# EasyEDA Pro project SCH_and_PCB.epro, board 运放2.0
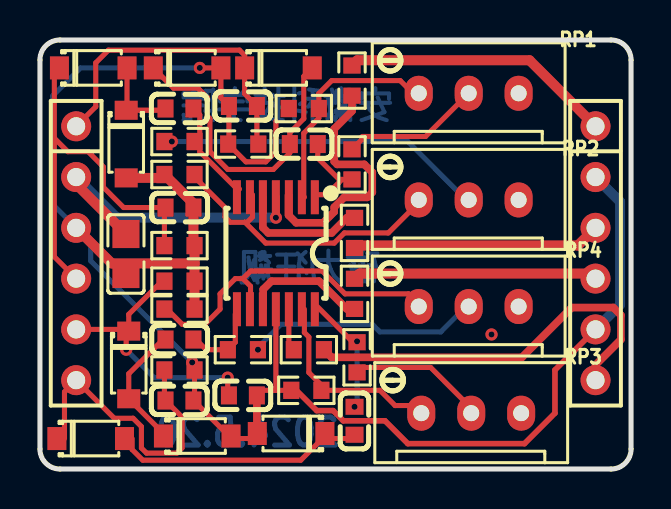
[diagram p12: board, top side]
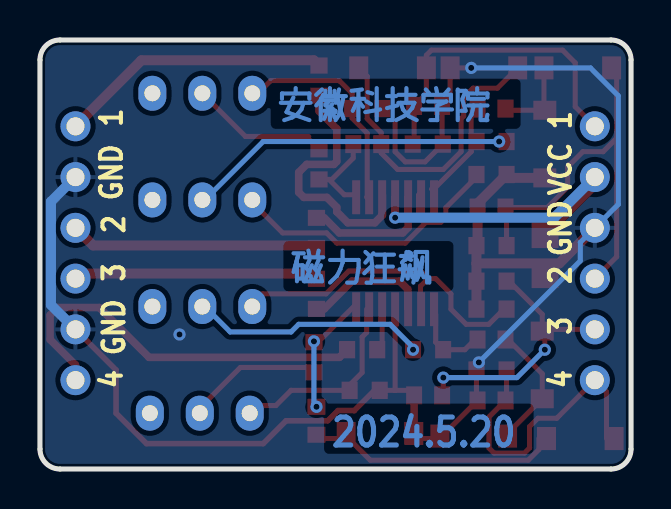
[diagram p13: board, bottom side, seen from below]

Outline 29.59 x 21.46 mm; copper layers: Top Layer, Bottom Layer. Coordinates in mm from the lower left corner of the outline.
Outline path: 0,20.46 0,1 arc(0.29,0.29) 1,0 28.59,0 arc(29.3,0.29) 29.59,1 29.59,20.46 arc(29.3,21.17) 28.59,21.46 1,21.46 arc(0.29,21.17) 0,20.46
Stack: Top Layer 0.035mm / Dielectric1 1.51mm FR4 er 4.5 / Bottom Layer 0.035mm

## Design rules (mm)
template: JLCPCB Capability(Two Layers Board)
spacing copperThickness1oz (default): track to track 0.102, other pairs 0.152 to 0.3
spacing copperThickness2oz: track to track 0.203, other pairs 0.152 to 0.3
track width copperThickness1oz (default): min 0.127, default 0.254, max 2.54
track width copperThickness2oz: min 0.203, default 0.254, max 2.54
differential pair differentialPair (default): width min 0.127, default 0.254, max 2.54; gap min 0.152, default 0.152
via viaSize (default): diameter min 0.5, default 0.61, max 10; hole min 0.3, default 0.305, max 6.3

## Placement (name value [footprint] x y rotation side)
C1  104  [C0603]  13.21 16.26 180 top
C2  104  [C0603]  10.16 18.16 0 top
C3  104  [C0603]  6.98 18.03 0 top
C4  104  [C0603]  6.98 13.08 180 top
C5  104  [C0603]  6.98 6.48 180 top
C6  104  [C0603]  10.16 3.68 0 top
C7  104  [C0603]  15.75 2.41 90 top
C8  104  [C0603]  6.98 3.43 0 top
C9  100nF  [C0805]  4.3 10.76 270 top
D1  B5819W  [SOD-123_L2.8-W1.8-LS3.7-RD]  11.94 20.07 0 top
D2  B5819W  [SOD-123_L2.8-W1.8-LS3.7-RD]  7.37 20.07 0 top
D3  B5819W  [SOD-123_L2.8-W1.8-LS3.7-RD]  2.67 20.07 0 top
D4  B5819W  [SOD-123_L2.8-W1.8-LS3.7-RD]  4.32 16.26 270 top
D5  B5819W  [SOD-123_L2.8-W1.8-LS3.7-RD]  4.44 5.21 270 top
D6  B5819W  [SOD-123_L2.8-W1.8-LS3.7-RD]  7.87 1.65 0 top
D7  B5819W  [SOD-123_L2.8-W1.8-LS3.7-RD]  2.54 1.52 0 top
D8  B5819W  [SOD-123_L2.8-W1.8-LS3.7-RD]  12.57 1.78 180 top
P1  IN  [HDR1X6-M]  27.81 17.14 270 top
P2  OUT  [HDR1X6-M]  1.81 17.14 270 top
R1  5.1K  [R0603]  15.62 19.43 270 top
R2  1K  [R0603]  13.21 18.03 0 top
R3  47K  [R0603]  15.62 15.24 270 top
R4  47k  [R0603]  10.18 16.26 0 top
R5  5.1k  [R0603]  15.75 11.81 90 top
R6  1k  [R0603]  6.98 14.73 0 top
R7  47k  [R0603]  6.98 16.38 0 top
R8  47K  [R0603]  6.98 11.18 180 top
R9  5.1K  [R0603]  15.75 8.76 90 top
R10  1K  [R0603]  6.98 8 0 top
R11  47K  [R0603]  10.16 5.97 0 top
R12  47k  [R0603]  6.98 9.4 0 top
R13  5.1K  [R0603]  13.46 5.97 0 top
R14  1K  [R0603]  13.33 3.94 180 top
R15  47k  [R0603]  15.88 5.59 270 top
R16  47k  [R0603]  6.98 4.95 0 top
RP1  100K  [RES-ADJ-TH_3296W-1-203]  21.46 18.8 180 top
RP2  100K  [RES-ADJ-TH_3296W-1-203]  21.46 13.46 180 top
RP3  100K  [RES-ADJ-TH_3296W-1-203]  21.59 2.79 180 top
RP4  100K  [RES-ADJ-TH_3296W-1-203]  21.46 8.13 180 top
U2  OPA4377AIPW  [TSSOP-14_L5.0-W4.4-P0.65-LS6.4-BL]  11.81 10.8 180 top

## Footprints (pads in the part's own frame, mm; a bottom-side part is the same pattern mirrored in y, then rotated)
C0603
  rect 0.8x0.9 smd: 1(-0.7,0) 2(0.7,0)
C0805
  rect 1.41x1.35 smd: 1(-1,0) 2(1,0)
HDR1X6-M
  round 1.5 hole 0.905x0.9: 1(0,0) 2(2.54,0) 3(5.08,0) 4(7.62,0) 5(10.16,0) 6(12.7,0)
R0603
  rect 0.806x0.864 smd: 1(-0.753,0) 2(0.753,0)
RES-ADJ-TH_3296W-1-203
  oval 1.4x1.75 hole 0.8: 1(-2.5,0) 2(0,0) 3(2.5,0)
SOD-123_L2.8-W1.8-LS3.7-RD
  rect 0.95x1.15 smd: 1(-1.692,0) 2(1.692,0)
TSSOP-14_L5.0-W4.4-P0.65-LS6.4-BL
  rect 0.4x1.7 smd: 1(-1.95,-2.8) 2(-1.3,-2.8) 3(-0.65,-2.8) 4(0,-2.8) 5(0.65,-2.8) 6(1.3,-2.8) 7(1.95,-2.8) 8(1.95,2.8) 9(1.3,2.8) 10(0.65,2.8) 11(0,2.8) 12(-0.65,2.8) 13(-1.3,2.8) 14(-1.95,2.8)

## Nets
As in the schematic.

Pads without a net: RP1 1; RP2 1; RP3 1; RP4 1

## Via types
v1: diameter 0.61, hole 0.305, Top Layer to Bottom Layer, 10 vias

## Routing (per net, layer and track width the routed paths; a pad name or vN(x,y) marks a point on that pad's centre or on a via; arc(x,y) is an arc through that point)
+5V: length 15.7
  Top Layer w0.38: v1(11.81,12.57) U2.4
  Top Layer w0.5: C9.1 1.81,14.25 P2.2
  Bottom Layer w0.5: v1(11.81,12.57) 3.84,12.57 P2.2
GND: length 92.3
  Top Layer w0.254: 10.75,1.52 9.57,1.52 9.57,1.55 C8.2 7.74,3.48 7.74,5.08 ; U2.11 11.81,3.94 11.81,3.94 ; 12.33,3.68 R14.2 11.81,3.94 ; 11.81,3.94 11.11,3.94 C6.2 ; v1(8,20.07) D2.2 9.06,18.56 C2.1 9.46,16.29 R4.1 10.31,15.37 11.3,15.37 11.81,15.88 11.81,17.39
  Top Layer w0.28: R14.2 12.84,3.94 13.86,2.92 14.68,2.92 15.18,2.41 17.27,2.41 18.41,1.27 24.26,1.27 25.78,2.79 25.78,4.95 P1.5
  Top Layer w0.38: C6.2 10.86,1.63 10.75,1.52
  Top Layer w0.5: P2.3 3.59,10.29 7.74,10.29 ; D4.2 6.06,14.56 R6.1 7.68,13.28 C4.1 7.68,11.23 R8.1 7.74,10.29 ; 7.74,10.29 R12.2 R10.2
  Bottom Layer w0.254: v1(7.62,5.33) 2.54,10.41 2.54,11.34 P2.3 0.63,13.24 0.63,18.67 2.03,20.07 v1(8,20.07)
  Bottom Layer w0.5: P1.5 29.04,8.21 29.04,13.38 P1.2
  vias: v1(22.61,6.73)
IN1: length 13.7
  Top Layer w0.5: R1.1 15.88,20.45 24.51,20.45 P1.1
IN2: length 12.6
  Top Layer w0.5: 15.62,11.18 26.93,11.18 P1.3
IN3: length 12.3
  Top Layer w0.5: P1.4 27.56,9.78 16.01,9.78 R9.2
IN4: length 20
  Top Layer w0.38: R13.2 14.6,5.59 24.13,5.59 26.62,8.08 28.7,8.08 29.08,7.7 29.08,6.48 27.81,5.21 P1.6
OPA1: length 4.4
  Top Layer w0.254: 13.89,13.72 14.36,13.72 15.12,14.49 ; C1.1 13.91,15.56 14.98,14.49 15.12,14.49 ; R3.2 15.12,14.49
OPA2: length 11.5
  Top Layer w0.254: 19.17,18.3 18.03,19.43 14.6,19.43 13.96,18.79 R2.2 13.96,17.55 13.21,16.8 13.21,13.62 13.24,13.59
OPA3: length 12.9
  Top Layer w0.38: R1.2 15.62,17.91 14.73,17.02 14.73,15.39 14.88,15.24 16.24,15.24 16.64,14.84 16.64,13.84 16.38,13.59 15.23,13.59 14.73,13.09 14.73,12.87 14.18,12.32 12.83,12.32 12.45,12.7 12.45,13.71
OPA5: length 6.5
  Top Layer w0.38: R5.2 15.36,12.56 14.6,11.81 11.43,11.81 11.16,12.08 U2.5
OPA6: length 15.3
  Top Layer w0.254: 7.74,14.61 9.27,13.07 9.27,12.6 9.53,12.34 10.26,12.34 ; 18.96,13.33 17.44,11.81 15.24,11.81 14.73,11.3 11.3,11.3 10.26,12.34 ; 10.26,12.34 10.38,12.34 10.64,12.6 10.64,13.72
OPA7: length 5.1
  Top Layer w0.254: 9.99,14.01 9.87,14.01 8,15.88 8,17.72 C3.2
OPA8: length 3.9
  Top Layer w0.254: 9.78,7.75 9.78,6.34 R11.1 8.32,5.97 7.68,6.6
OPA9: length 16.9
  Top Layer w0.254: 6.23,8.13 7.12,7.24 8.25,7.24 9.02,8 9.02,8.76 9.78,9.53 10.16,9.53 ; 10.16,9.53 10.54,9.91 14.13,9.91 15.27,8.76 18.45,8.76 18.96,8.25 ; 10.16,9.53 10.54,9.14 10.54,8.09
OPA10: length 6.3
  Top Layer w0.38: R9.1 15.36,8.01 13.97,9.4 11.59,9.4 11.18,8.99 11.18,8.05
OPA12: length 2.1
  Top Layer w0.254: R13.1 12.46,6.22 U2.12
OPA13: length 9.6
  Top Layer w0.254: 18.96,3.17 17.78,3.17 17.02,3.94 R14.1 14.09,4.2 13.46,4.83 13.46,6.6 13.24,6.83 13.24,8
OPA14: length 6.1
  Top Layer w0.254: R15.1 15.67,6.34 13.89,8.12
  Bottom Layer w0.254: v1(15.88,6.39) 15.88,3.24 v1(15.75,3.11)
OUT1: length 16.1
  Top Layer w0.254: R4.2 10.86,16.33 C2.2 10.25,18.78 D1.1 10.25,20.7 9.99,20.95 3.43,20.95 2.79,20.32 2.79,18.13 P2.1
OUT2: length 20.6
  Top Layer w0.254: 0.72,16.55 1.4,15.88 2.41,15.88 3.17,15.11 3.17,14.1 4.19,13.08 C4.2 6.23,13.03 R8.2 ; 0.72,16.55 0.72,19.71 0.97,19.97 D3.1 ; 0.72,16.55 0.72,10.62 P2.4
OUT3: length 13.6
  Top Layer w0.254: D5.1 4.44,7.74 6.23,9.53 ; D5.1 4.32,6.77 v1(4.32,5.97) ; D5.1 4.36,6.98 P2.5 ; v1(9.4,4.57) 9.4,3.75 C6.1
  Bottom Layer w0.254: v1(9.4,4.57) 5.71,4.57 v1(4.32,5.97)
OUT4: length 15.1
  Top Layer w0.254: 1.23,1.52 1.23,3.86 P2.6 3.72,2.54 4.66,2.54 5.08,2.12 5.08,1.05 5.33,0.8 6.86,0.8 7.11,1.05 7.11,2.6 C8.1 6.23,3.48 6.23,5.08
$1N136: length 4.1
  Top Layer w0.254: D3.2 4.36,17.99 D4.1 6.2,17.95 C3.1
$1N137: length 16.1
  Bottom Layer w0.254: 21.46,13.33 18.41,16.38 v1(6.6,16.38)
$1N146: length 12.4
  Top Layer w0.254: 4.61,1.52 4.61,0.97 5.15,0.44 13.06,0.44 14.14,1.52 15.56,1.52 C7.1
$1N147: length 6.5
  Top Layer w0.254: R15.2 16.12,5.08 19.56,5.08 21.46,3.17
$1N192: length 6.8
  Top Layer w0.254: 16.14,16.64 19.3,16.64 21.08,18.42 21.46,18.42 ; R3.1 16.14,16.51
$1N206: length 6.6
  Top Layer w0.254: 6.28,6.6 4.44,4.76 D5.2 6.18,1.78 6.18,1.52
$1N209: length 15.5
  Top Layer w0.254: D2.1 6.69,19.05 7.91,19.05 8.38,18.58 8.38,17.65 8.51,17.53 8.51,15.88 9.4,14.99 11.68,14.99 12.51,15.81 C1.2 12.51,16.83 13.21,17.53 13.21,19.64 D1.2
$1N214: length 11.9
  Bottom Layer w0.254: v1(10.91,5.97) 10.91,6.09 12.06,7.24 16.64,7.24 17.02,6.86 20.07,6.86 21.46,8.25

## Copper pours and planes (outline as drawn; the poured copper is in the pictures)
GND on Bottom Layer: 32,24.38 32,-2.16 -3.18,-2.16 -3.18,24.38

## Text on the board
Bottom Layer: 2024.5.20 | 磁力狂飙 | 安徽科技学院
Bottom Solder Mask Layer: 2024.5.20 | 磁力狂飙 | 安徽科技学院
Bottom Silkscreen Layer: 1 | VCC | GND | 2 | 3 | 4
